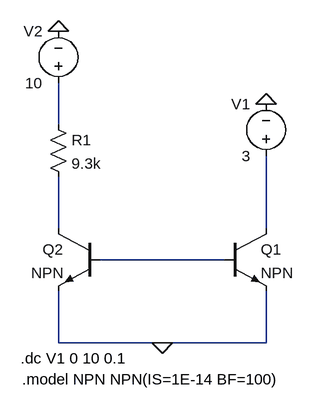
[diagram p0: schematic Current_Mirror_NPN.asc]
Current_Mirror_NPN.asc, the LTspice schematic file:
Version 4
SHEET 1 880 680
WIRE -192 32 -192 -32
WIRE -192 192 -192 112
WIRE 128 192 128 80
WIRE 64 240 -128 240
WIRE -192 368 -192 288
WIRE -32 368 -192 368
WIRE 128 368 128 288
WIRE 128 368 -32 368
FLAG 128 0 0
FLAG -32 368 0
FLAG -192 -112 0
SYMBOL npn 64 192 R0
SYMATTR InstName Q1
SYMBOL npn -128 192 M0
SYMATTR InstName Q2
SYMBOL voltage 128 96 R180
WINDOW 0 24 96 Left 2
WINDOW 3 24 16 Left 2
WINDOW 123 0 0 Left 2
WINDOW 39 0 0 Left 2
SYMATTR InstName V1
SYMATTR Value 3
SYMBOL res -208 16 R0
SYMATTR InstName R1
SYMATTR Value 9.3k
SYMBOL voltage -192 -16 R180
WINDOW 0 24 96 Left 2
WINDOW 3 24 16 Left 2
SYMATTR InstName V2
SYMATTR Value 10
TEXT -250 392 Left 2 !.dc V1 0 10 0.1
TEXT -248 424 Left 2 !.model NPN NPN(IS=1E-14 BF=100)

The netlist it stands for:
* Current_Mirror_NPN.asc
Q1 N003 N004 0 0 NPN
Q2 N002 N004 0 0 NPN
V1 N003 0 3
R1 N001 N002 9.3k
V2 N001 0 10
.model NPN NPN
.model PNP PNP
.lib standard.bjt
.dc V1 0 10 0.1
.model NPN NPN(IS=1E-14 BF=100)
.backanno
.end